# EAGLE board STM32H750VBT6_ultra (EAGLE 9.6.2)
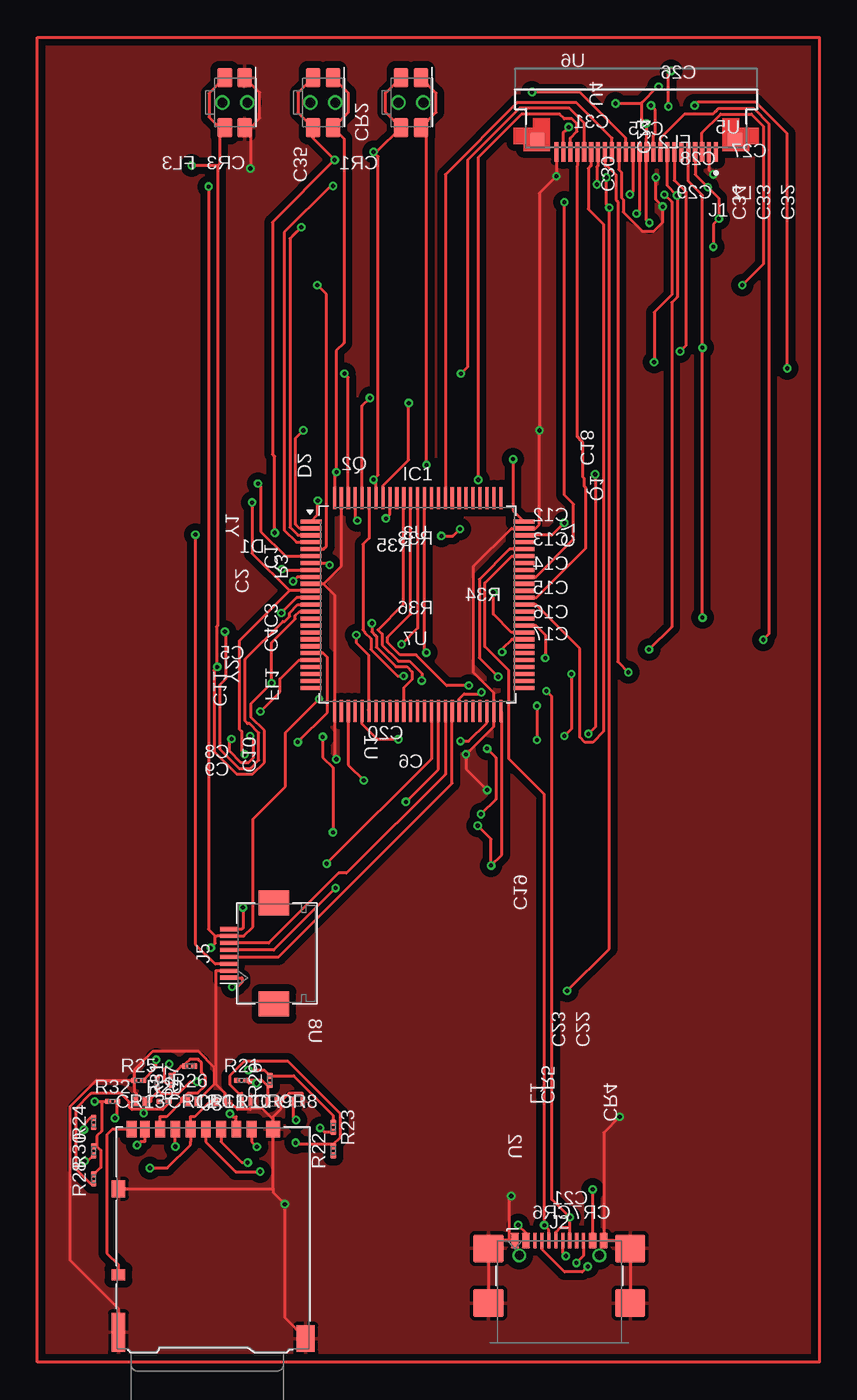
[diagram p6: board, top side]
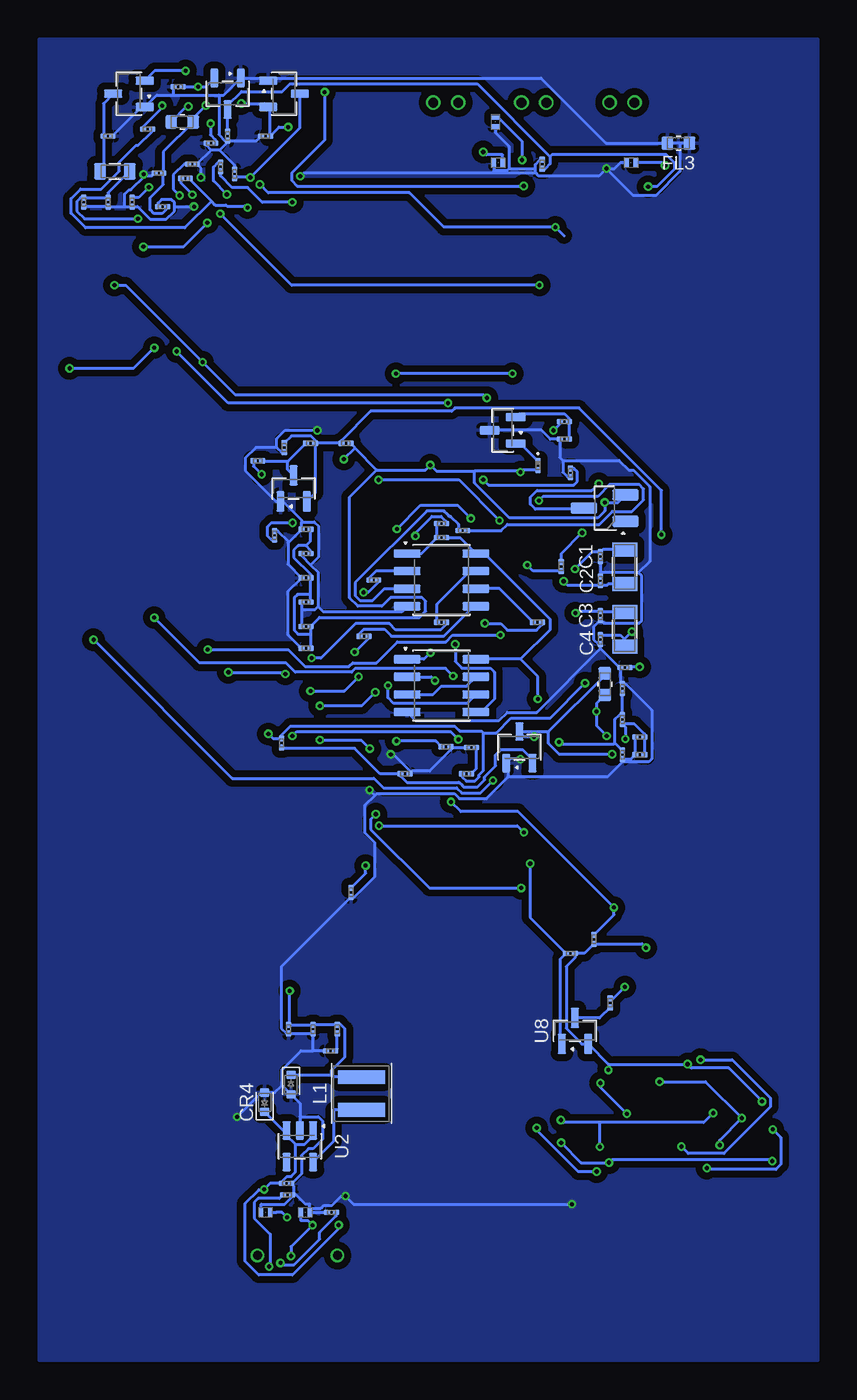
[diagram p7: board, bottom side, seen from below]

No outline drawn. Coordinates in mm, seen from the top.
Copper layers (1*16): Top 0.035mm / dielectric 1.5mm / Bottom 0.035mm
Design rules "Fusion Electronics Design Rules": minimum track width 0mil, minimum drill 0.3mm, track to track 0mil, track to pad 0mil, pad to pad 0mil, via to via 0mil, smd to smd 0mil, copper to edge 0.5mm, drill to drill 0.25mm, minimum pad ring 0.1mm, minimum via ring 0.1mm, stop-mask expansion 0mil, vias tented up to drill 9999mil, thermal gap 10mil
Net classes: 0 Default: width 0.2 mm, drill 0.3 mm, clearance 0.2 mm

## Footprints (pad centres in the part's own frame; a part is rotated, then mirrored left to right if it is on the bottom)
CAPACITOR_SMD_C_0201_0603METRIC = smd 0.46 x 0.4: 1 -0.32,0; 2 0.32,0
CAPACITOR_SMD_C_0201_0603METRIC_V1 = smd 0.46 x 0.4: 1 -0.32,0; 2 0.32,0
FOOTPRINTS_SP0402_LTF_V1 = smd 0.305 x 0.559: 1 -0.318,0; 2 0.318,0
DIODE_SMD_D_SOD-523_V1 = smd 0.6 x 0.7: 1 -0.7,0; 2 0.7,0
DIODE_SMD_D_SOD-523 = smd 0.6 x 0.7: 1 -0.7,0; 2 0.7,0
FOOTPRINTS_SP0402_LTF = smd 0.305 x 0.559: 1 -0.318,0; 2 0.318,0
PACKAGE_TO_SOT_SMD_SOT-23_HANDSOLDERING = smd 1.9 x 0.8: 1 -1.5,0.95; 2 -1.5,-0.95; 3 1.5,0
LED_SMD_LED_0201_0603METRIC = smd 0.46 x 0.4: 1 -0.32,0; 2 0.32,0
INDUCTOR_SMD_L_0603_1608METRIC = smd 0.875 x 0.95: 1 -0.787,0; 2 0.787,0
PACKAGE_QFP_LQFP-100_14X14MM_P0.5MM = smd 1.6 x 0.3: 1 -7.675,6; 2 -7.675,5.5; 3 -7.675,5; 4 -7.675,4.5; 5 -7.675,4; 6 -7.675,3.5; 7 -7.675,3; 8 -7.675,2.5; 9 -7.675,2; 10 -7.675,1.5; 11 -7.675,1; 12 -7.675,0.5; 13 -7.675,0; 14 -7.675,-0.5; 15 -7.675,-1; 16 -7.675,-1.5; 17 -7.675,-2; 18 -7.675,-2.5; 19 -7.675,-3; 20 -7.675,-3.5; 21 -7.675,-4; 22 -7.675,-4.5; 23 -7.675,-5; 24 -7.675,-5.5; 25 -7.675,-6; 51 7.675,-6; 52 7.675,-5.5; 53 7.675,-5; 54 7.675,-4.5; 55 7.675,-4; 56 7.675,-3.5; 57 7.675,-3; 58 7.675,-2.5; 59 7.675,-2; 60 7.675,-1.5; 61 7.675,-1; 62 7.675,-0.5; 63 7.675,0; 64 7.675,0.5; 65 7.675,1; 66 7.675,1.5; 67 7.675,2; 68 7.675,2.5; 69 7.675,3; 70 7.675,3.5; 71 7.675,4; 72 7.675,4.5; 73 7.675,5; 74 7.675,5.5; 75 7.675,6 | smd 0.3 x 1.6: 26 -6,-7.675; 27 -5.5,-7.675; 28 -5,-7.675; 29 -4.5,-7.675; 30 -4,-7.675; 31 -3.5,-7.675; 32 -3,-7.675; 33 -2.5,-7.675; 34 -2,-7.675; 35 -1.5,-7.675; 36 -1,-7.675; 37 -0.5,-7.675; 38 0,-7.675; 39 0.5,-7.675; 40 1,-7.675; 41 1.5,-7.675; 42 2,-7.675; 43 2.5,-7.675; 44 3,-7.675; 45 3.5,-7.675; 46 4,-7.675; 47 4.5,-7.675; 48 5,-7.675; 49 5.5,-7.675; 50 6,-7.675; 76 6,7.675; 77 5.5,7.675; 78 5,7.675; 79 4.5,7.675; 80 4,7.675; 81 3.5,7.675; 82 3,7.675; 83 2.5,7.675; 84 2,7.675; 85 1.5,7.675; 86 1,7.675; 87 0.5,7.675; 88 0,7.675; 89 -0.5,7.675; 90 -1,7.675; 91 -1.5,7.675; 92 -2,7.675; 93 -2.5,7.675; 94 -3,7.675; 95 -3.5,7.675; 96 -4,7.675; 97 -4.5,7.675; 98 -5,7.675; 99 -5.5,7.675; 100 -6,7.675
AMPHENOL_SFV24R-3STBE1HLF = smd 0.3 x 1.4: 1 -5.75,1.25; 2 -5.25,1.25; 3 -4.75,1.25; 4 -4.25,1.25; 5 -3.75,1.25; 6 -3.25,1.25; 7 -2.75,1.25; 8 -2.25,1.25; 9 -1.75,1.25; 10 -1.25,1.25; 11 -0.75,1.25; 12 -0.25,1.25; 13 0.25,1.25; 14 0.75,1.25; 15 1.25,1.25; 16 1.75,1.25; 17 2.25,1.25; 18 2.75,1.25; 19 3.25,1.25; 20 3.75,1.25; 21 4.25,1.25; 22 4.75,1.25; 23 5.25,1.25; 24 5.75,1.25 | smd 1 x 1: SH1 -7.12,0.38; SH2 7.12,0.38
CONNECTOR_USB_USB_C_RECEPTACLE_GCT_USB4110 = smd 0.6 x 1.15: A1 -3.2,3.68; A4 -2.4,3.68; A9 2.4,3.68; A12 3.2,3.68; B1 3.2,3.68; B4 2.4,3.68; B9 -2.4,3.68; B12 -3.2,3.68 | smd 0.3 x 1.15: A5 -1.25,3.68; A6 -0.25,3.68; A7 0.25,3.68; A8 1.25,3.68; B5 1.75,3.68; B6 0.75,3.68; B7 -0.75,3.68; B8 -1.75,3.68 | smd 2.18 x 2: S1_1 -5.11,3.105; S1_2 -5.11,-0.825; S1_3 5.11,3.105; S1_4 5.11,-0.825 | drill 0.65 pad 0.65: UN_1 -2.89,2.605; UN_2 2.89,2.605
CONNECTOR_CARD_MICROSD_HC_HIROSE_DM3AT-SF-PEJM5 = smd 0.7 x 1.2: 1 2.775,7.725; 2 1.675,7.725; 3 0.575,7.725; 4 -0.525,7.725; 5 -1.625,7.725; 6 -2.725,7.725; 7 -3.825,7.725; 8 -4.925,7.725; 9 -5.875,7.725 | smd 1 x 0.8: 10 -6.825,-2.775 | smd 1 x 1.2: 11_1 -6.825,3.425; 11_3 4.325,7.725 | smd 1 x 2.8: 11_2 -6.825,-6.925 | smd 1.3 x 1.9: 11_4 6.675,-7.375
CONNECTOR_FFC-FPC_HIROSE_FH12-8S-0.5SH_1X08-1MP_P0.50MM_HORIZONTAL = smd 0.3 x 1.3: 1 -1.75,1.85; 2 -1.25,1.85; 3 -0.75,1.85; 4 -0.25,1.85; 5 0.25,1.85; 6 0.75,1.85; 7 1.25,1.85; 8 1.75,1.85 | smd 1.8 x 2.2: MP_1 -3.65,-1.4; MP_2 3.65,-1.4
INDUCTOR_SMD_L_COILCRAFT_XXL4020 = smd 0.98 x 3.4: 1 -1.185,0; 2 1.185,0
INDUCTOR_SMD_L_0805_2012METRIC = smd 0.875 x 1.2: 1 -1.062,0; 2 1.062,0
PACKAGE_TO_SOT_SMD_SOT-23 = smd 1.475 x 0.6: 1 -0.938,0.95; 2 -0.938,-0.95; 3 0.938,0
RESISTOR_SMD_R_0201_0603METRIC = smd 0.46 x 0.4: 1 -0.32,0; 2 0.32,0
RESISTOR_SMD_R_0201_0603METRIC_V1 = smd 0.46 x 0.4: 1 -0.32,0; 2 0.32,0
BUTTON_SWITCH_SMD_SW_SPST_EVQP7C = smd 1.4 x 1.05: 1_1 -1.8,0.72; 1_2 1.8,0.72; 2_1 -1.8,-0.72; 2_2 1.8,-0.72 | drill 0.7 pad 0.7: UN_1 0,0.9; UN_2 0,-0.9
PACKAGE_TO_SOT_SMD_SOT-23-3 = smd 1.325 x 0.6: 1 -1.137,0.95; 2 -1.137,-0.95; 3 1.137,0
PACKAGE_TO_SOT_SMD_SOT-23-5 = smd 1.325 x 0.6: 1 -1.137,0.95; 2 -1.137,0; 3 -1.137,-0.95; 4 1.137,-0.95; 5 1.137,0.95
PACKAGE_SO_SOIC-8_3.9X4.9MM_P1.27MM = smd 1.95 x 0.6: 1 -2.475,1.905; 2 -2.475,0.635; 3 -2.475,-0.635; 4 -2.475,-1.905; 5 2.475,-1.905; 6 2.475,-0.635; 7 2.475,0.635; 8 2.475,1.905
PACKAGE_TO_SOT_SMD_SOT-23-3_V1 = smd 1.325 x 0.6: 1 -1.137,0.95; 2 -1.137,-0.95; 3 1.137,0
CRYSTAL_CRYSTAL_SMD_3215-2PIN_3.2X1.5MM = smd 1 x 1.8: 1 1.25,0; 2 -1.25,0

## Placement (x,y rotation side)
C1  CL10C100JB8NNNC  [CAPACITOR_SMD_C_0201_0603METRIC]  132.63,121.58 90 bottom
C2  CL10C100JB8NNNC  [CAPACITOR_SMD_C_0201_0603METRIC]  132.63,119.83 270 bottom
C3  CL10C100JB8NNNC  [CAPACITOR_SMD_C_0201_0603METRIC]  132.63,117.33 90 bottom
C4  CL10C100JB8NNNC  [CAPACITOR_SMD_C_0201_0603METRIC]  132.63,115.58 90 bottom
C5  CL10C100JB8NNNC  [CAPACITOR_SMD_C_0201_0603METRIC]  130.88,113.58 0 bottom
C6  CL10C100JB8NNNC  [CAPACITOR_SMD_C_0201_0603METRIC]  143.76,107.86 180 bottom
C7  CL10C100JB8NNNC  [CAPACITOR_SMD_C_0201_0603METRIC]  156.12,123.11 270 bottom
C8  CL10C100JB8NNNC  [CAPACITOR_SMD_C_0201_0603METRIC]  129.78,108.56 180 bottom
C9  CL10C100JB8NNNC  [CAPACITOR_SMD_C_0201_0603METRIC]  129.78,107.29 180 bottom
C10  CL10C100JB8NNNC  [CAPACITOR_SMD_C_0201_0603METRIC]  131.05,107.29 90 bottom
C11  CL10C100JB8NNNC  [CAPACITOR_SMD_C_0201_0603METRIC]  131.05,112.05 270 bottom
C12  CL10C100JB8NNNC  [CAPACITOR_SMD_C_0201_0603METRIC]  153.86,123.54 0 bottom
C13  CL10C100JB8NNNC  [CAPACITOR_SMD_C_0201_0603METRIC]  153.86,121.79 0 bottom
C14  CL10C100JB8NNNC  [CAPACITOR_SMD_C_0201_0603METRIC]  153.86,120.04 0 bottom
C15  CL10C100JB8NNNC  [CAPACITOR_SMD_C_0201_0603METRIC]  153.86,118.29 0 bottom
C16  CL10C100JB8NNNC  [CAPACITOR_SMD_C_0201_0603METRIC]  153.86,116.54 0 bottom
C17  CL10C100JB8NNNC  [CAPACITOR_SMD_C_0201_0603METRIC]  153.86,114.96 0 bottom
C18  CL10C100JB8NNNC  [CAPACITOR_SMD_C_0201_0603METRIC_V1]  155.43,129.43 90 bottom
C19  CL10C100JB8NNNC  [CAPACITOR_SMD_C_0201_0603METRIC]  150.6,97.37 90 bottom
C20  CL10C100JB8NNNC  [CAPACITOR_SMD_C_0201_0603METRIC]  141.94,107.82 0 bottom
C21  CL10C100JB8NNNC  [CAPACITOR_SMD_C_0201_0603METRIC]  155.26,76.39 180 bottom
C22  CL10C100JB8NNNC  [CAPACITOR_SMD_C_0201_0603METRIC]  155.1,87.5 90 bottom
C23  CL10C100JB8NNNC  [CAPACITOR_SMD_C_0201_0603METRIC]  153.35,87.5 90 bottom
C24  CL10C100JB8NNNC  [CAPACITOR_SMD_C_0201_0603METRIC]  159.51,151.89 90 bottom
C25  CL10C100JB8NNNC  [CAPACITOR_SMD_C_0201_0603METRIC]  160.72,151.38 0 bottom
C26  CL10C100JB8NNNC  [CAPACITOR_SMD_C_0201_0603METRIC]  163.07,155.45 0 bottom
C27  CL10C100JB8NNNC  [CAPACITOR_SMD_C_0201_0603METRIC]  168.15,151.89 180 bottom
C28  CL10C100JB8NNNC  [CAPACITOR_SMD_C_0201_0603METRIC]  164.47,149.22 0 bottom
C29  CL10C100JB8NNNC  [CAPACITOR_SMD_C_0201_0603METRIC]  164.21,146.81 0 bottom
C30  CL10C100JB8NNNC  [CAPACITOR_SMD_C_0201_0603METRIC]  159,149.16 270 bottom
C31  CL10C100JB8NNNC  [CAPACITOR_SMD_C_0201_0603METRIC]  156.78,151.89 0 bottom
C32  CL10C100JB8NNNC  [CAPACITOR_SMD_C_0201_0603METRIC]  169.88,147.13 90 bottom
C33  CL10C100JB8NNNC  [CAPACITOR_SMD_C_0201_0603METRIC]  168.13,147.13 90 bottom
C34  CL10C100JB8NNNC  [CAPACITOR_SMD_C_0201_0603METRIC_V1]  166.38,147.13 90 bottom
C35  CL10C100JB8NNNC  [CAPACITOR_SMD_C_0201_0603METRIC]  136.82,149.86 270 bottom
CR1  SP0402B-ULC-01ETG  [FOOTPRINTS_SP0402_LTF_V1]  140,149.97 0 bottom
CR2  SP0402B-ULC-01ETG  [FOOTPRINTS_SP0402_LTF_V1]  140.21,152.91 90 bottom
CR3  SP0402B-ULC-01ETG  [FOOTPRINTS_SP0402_LTF_V1]  130.43,149.97 0 bottom
CR4  LESD5Z5.0CT1G  [DIODE_SMD_D_SOD-523_V1]  156.84,82.23 90 bottom
CR5  LESD5Z5.0CT1G  [DIODE_SMD_D_SOD-523]  154.94,83.5 270 bottom
CR6  SP0402B-ULC-01ETG  [FOOTPRINTS_SP0402_LTF_V1]  153.92,74.3 180 bottom
CR7  SP0402B-ULC-01ETG  [FOOTPRINTS_SP0402_LTF_V1]  156.78,74.3 0 bottom
CR8  SP0402B-ULC-01ETG  [FOOTPRINTS_SP0402_LTF]  135.64,82.3 0 top
CR9  SP0402B-ULC-01ETG  [FOOTPRINTS_SP0402_LTF]  133.79,82.3 0 top
CR10  SP0402B-ULC-01ETG  [FOOTPRINTS_SP0402_LTF]  131.89,82.3 0 top
CR11  SP0402B-ULC-01ETG  [FOOTPRINTS_SP0402_LTF]  130.05,82.3 180 top
CR12  SP0402B-ULC-01ETG  [FOOTPRINTS_SP0402_LTF]  128.02,82.3 180 top
CR13  SP0402B-ULC-01ETG  [FOOTPRINTS_SP0402_LTF]  124.27,82.3 0 top
D1  BAT54C-7-F  [PACKAGE_TO_SOT_SMD_SOT-23_HANDSOLDERING]  132.32,125.07 180 bottom
D2  APT1608QBC_D  [LED_SMD_LED_0201_0603METRIC]  137.14,128.14 270 bottom
FL1  MMZ1608Y102BTA00  [INDUCTOR_SMD_L_0603_1608METRIC]  132.32,112.37 90 bottom
FL2  MMZ1608Y102BTA00  [INDUCTOR_SMD_L_0603_1608METRIC]  162.79,152.91 180 bottom
FL3  MMZ1608Y102BTA00  [INDUCTOR_SMD_L_0603_1608METRIC]  127,151.38 180 bottom
IC1  STM32H750VBT6  [PACKAGE_QFP_LQFP-100_14X14MM_P0.5MM]  144.26,118.11 0 top
J1  SFV24R-3STBE1HLF  [AMPHENOL_SFV24R-3STBE1HLF]  160.02,152 180 top
J2  USB_C_Receptacle_USB2.0_16P  [CONNECTOR_USB_USB_C_RECEPTACLE_GCT_USB4110]  154.48,68.58 0 top
J3  Micro_SD_Card_Det_Hirose_DM3AT  [CONNECTOR_CARD_MICROSD_HC_HIROSE_DM3AT-SF-PEJM5]  129.51,72.57 0 top
J5  5051100892  [CONNECTOR_FFC-FPC_HIROSE_FH12-8S-0.5SH_1X08-1MP_P0.50MM_HORIZONTAL]  132.5,92.96 90 top
L1  SRP4020TA-2R2M  [INDUCTOR_SMD_L_COILCRAFT_XXL4020]  149.86,82.87 90 bottom
L2  MLZ2012M100W  [INDUCTOR_SMD_L_0805_2012METRIC]  167.64,149.35 180 bottom
Q1  MMBT3906  [PACKAGE_TO_SOT_SMD_SOT-23]  154.75,126.49 90 bottom
Q2  BC857  [PACKAGE_TO_SOT_SMD_SOT-23]  139.68,130.68 180 bottom
R1  R  [RESISTOR_SMD_R_0201_0603METRIC]  134.8,127.61 90 bottom
R2  R  [RESISTOR_SMD_R_0201_0603METRIC]  131.05,109.83 90 bottom
R3  R  [RESISTOR_SMD_R_0201_0603METRIC_V1]  135.46,120.86 270 bottom
R4  R  [RESISTOR_SMD_R_0201_0603METRIC]  157.33,128.47 0 bottom
R5  R  [RESISTOR_SMD_R_0201_0603METRIC]  135.23,131.31 0 bottom
R6  R  [RESISTOR_SMD_R_0201_0603METRIC]  135.23,130.04 180 bottom
R7  R  [RESISTOR_SMD_R_0201_0603METRIC]  153.52,129.74 180 bottom
R8  R  [RESISTOR_SMD_R_0201_0603METRIC]  150.98,129.74 180 bottom
R9  R  [RESISTOR_SMD_R_0201_0603METRIC]  155.62,108.14 90 bottom
R10  R  [RESISTOR_SMD_R_0201_0603METRIC]  146.73,105.92 0 bottom
R11  R  [RESISTOR_SMD_R_0201_0603METRIC]  142.28,105.92 0 bottom
R12  R  [RESISTOR_SMD_R_0201_0603METRIC]  151.6,87.5 90 bottom
R13  R  [RESISTOR_SMD_R_0201_0603METRIC]  152.09,85.94 0 bottom
R14  R  [RESISTOR_SMD_R_0201_0603METRIC]  155.19,75.56 180 bottom
R15  R  [RESISTOR_SMD_R_0201_0603METRIC]  152.01,74.3 0 bottom
R16  R  [RESISTOR_SMD_R_0201_0603METRIC]  160.02,149.67 90 bottom
R17  R  [RESISTOR_SMD_R_0201_0603METRIC]  162.56,148.84 180 bottom
R18  R  [RESISTOR_SMD_R_0201_0603METRIC]  165.29,152.4 180 bottom
R19  R  [RESISTOR_SMD_R_0201_0603METRIC]  162.05,149.86 180 bottom
R20  R  [RESISTOR_SMD_R_0201_0603METRIC]  125.98,82.3 0 top
R21  R  [RESISTOR_SMD_R_0201_0603METRIC]  131.57,83.82 0 top
R22  R  [RESISTOR_SMD_R_0201_0603METRIC]  138.18,78.74 90 top
R23  R  [RESISTOR_SMD_R_0201_0603METRIC]  138.18,80.43 270 top
R24  R  [RESISTOR_SMD_R_0201_0603METRIC]  120.9,80.77 90 top
R25  R  [RESISTOR_SMD_R_0201_0603METRIC]  124.14,83.82 0 top
R26  R  [RESISTOR_SMD_R_0201_0603METRIC]  127.83,84.84 180 top
R27  R  [RESISTOR_SMD_R_0201_0603METRIC]  125.48,83.63 270 top
R28  R  [RESISTOR_SMD_R_0201_0603METRIC]  120.9,76.71 90 top
R29  R  [RESISTOR_SMD_R_0201_0603METRIC]  133.6,83.82 90 top
R30  R  [RESISTOR_SMD_R_0201_0603METRIC]  120.9,78.74 90 top
R31  R  [RESISTOR_SMD_R_0201_0603METRIC]  126.49,83.82 90 top
R32  R  [RESISTOR_SMD_R_0201_0603METRIC]  122.27,82.3 0 top
R33  R  [RESISTOR_SMD_R_0201_0603METRIC_V1]  144.08,123.95 180 bottom
R34  R  [RESISTOR_SMD_R_0201_0603METRIC_V1]  148.98,119.89 180 bottom
R35  R  [RESISTOR_SMD_R_0201_0603METRIC_V1]  142.56,123.44 180 bottom
R36  R  [RESISTOR_SMD_R_0201_0603METRIC_V1]  144.08,116.84 0 bottom
R37  R  [RESISTOR_SMD_R_0201_0603METRIC]  137.16,116.84 0 bottom
R38  R  [RESISTOR_SMD_R_0201_0603METRIC]  149.67,115.82 0 bottom
R39  R  [RESISTOR_SMD_R_0201_0603METRIC]  144.08,122.94 0 bottom
R40  R  [RESISTOR_SMD_R_0201_0603METRIC]  133.1,93.98 90 bottom
R41  R  [RESISTOR_SMD_R_0201_0603METRIC]  134.78,92.96 0 bottom
R42  R  [RESISTOR_SMD_R_0201_0603METRIC]  131.92,89.41 270 bottom
SW1  SW_Push  [BUTTON_SWITCH_SMD_SW_SPST_EVQP7C]  143.78,154.31 270 top
SW2  SW_Push  [BUTTON_SWITCH_SMD_SW_SPST_EVQP7C]  137.43,154.31 270 top
SW3  SW_Push  [BUTTON_SWITCH_SMD_SW_SPST_EVQP7C]  131.07,154.31 270 top
U1  MAX809TEUR_T  [PACKAGE_TO_SOT_SMD_SOT-23-3]  138.47,107.82 90 bottom
U2  AP2112K-3.3  [PACKAGE_TO_SOT_SMD_SOT-23-5]  154.31,79.06 270 bottom
U3  W25Q64JVSSIQ  [PACKAGE_SO_SOIC-8_3.9X4.9MM_P1.27MM]  144.08,119.89 0 bottom
U4  PMIC-LDO-XC6206P332MR-G_SOT23_  [PACKAGE_TO_SOT_SMD_SOT-23-3_V1]  159.51,154.94 270 bottom
U5  PMIC-LDO-XC6206P332MR-G_SOT23_  [PACKAGE_TO_SOT_SMD_SOT-23-3_V1]  166.62,154.94 180 bottom
U6  PMIC-LDO-XC6206P332MR-G_SOT23_  [PACKAGE_TO_SOT_SMD_SOT-23-3_V1]  155.45,154.94 0 bottom
U7  W25Q64JVSSIQ  [PACKAGE_SO_SOIC-8_3.9X4.9MM_P1.27MM]  144.08,112.27 0 bottom
U8  SI2301CDS-T1-GE3  [PACKAGE_TO_SOT_SMD_SOT-23]  134.46,87.38 90 bottom
Y1  ABS05-32.768KHZ-7-T  [CRYSTAL_CRYSTAL_SMD_3215-2PIN_3.2X1.5MM]  130.88,120.83 270 bottom
Y2  ABM3-25.000MHZ-D2Y-T  [CRYSTAL_CRYSTAL_SMD_3215-2PIN_3.2X1.5MM]  130.88,116.33 90 bottom

## Tracks (layer width: path | path; a pad name or v marks a point on that pad's centre or on a via)
0.96''_TFT-LCD_LCD_LEDA  (via drill 0.3 pad 0.6)
  Top 0.2: v130.87,90.54 | v130.87,90.54 131.27,90.54 131.6,90.88 131.6,91.21 J5.1
  Bottom 0.2: v130.87,90.54 131.69,89.73 R42.1
+1V5  (via drill 0.3 pad 0.6)
  Top 0.2: J1.10 161.27,151.95 161.4,152.07 161.4,153.79 v161.09,154.1
  Bottom 0.2: C29.2 164,146.71 164,146.55 164.24,146.31 164.84,146.31 165.11,146.57 165.11,147.44 164.15,148.4 C28.2 164.15,150.76 FL2.1 162,153.19 v161.09,154.1
+2V8  (via drill 0.3 pad 0.6)
  Top 0.2: 160.43,154.24 v158.53,154.24 | v160.97,145.64 160.77,145.84 J1.11 160.77,151.75 160.77,152.77 v160.74,152.8 160.43,153.11 160.43,154.24 | v155.15,152.54 154.86,152.26 154.77,152.17 J1.23 | 160.43,154.24 160.43,154.31 161.56,155.45 v161.64,155.45 | J1.4 164.27,149.12 v165.19,148.21 165.99,147.41 | v165.59,143.91 165.59,145.53 v165.99,145.93 165.99,147.41 | 165.99,147.41
  Bottom 0.2: C26.2 v161.64,155.45 161.09,155.45 U4.2 | L2.1 168.13,147.79 C33.2 C32.2 170.11,147.45 170.39,147.17 170.39,146.48 169.84,145.93 v165.99,145.93 | v165.59,143.91 162.7,143.91 v160.97,145.64 | v160.74,152.8 160.74,151.99 160.4,151.65 C25.2 | C34.2 165.94,147.45 v165.19,148.21 | v158.53,154.24 156.84,154.24 U6.2 156.46,153.87 C31.2 155.81,152.54 v155.15,152.54 | v155.15,152.54
+3.3V  (via drill 0.3 pad 0.6)
  Top 0.2: v155.04,90.26 158.08,93.3 v158.08,146.73 157.87,146.94 v157.87,148.92
  Bottom 0.2: L1.2 151.86,84.05 152.01,84.2 | 160.68,147.21 162.6,145.28 169.76,145.28 170.8,146.32 170.8,147.39 170.12,148.07 168.63,148.07 167.33,149.38 167.33,150.01 166.12,151.22 165.97,151.22 164.97,152.22 R18.1 | v158.08,146.73 158.19,146.73 158.31,146.86 159.56,146.86 159.63,146.93 160.4,146.93 160.68,147.21 | R17.1 162.24,148.77 160.68,147.21 | 152.01,84.2 152.01,84.53 151.06,85.49 151.06,87.53 151.35,87.82 R12.2 C23.2 155.04,87.82 | U6.3 154.31,152.48 v157.87,148.92 158.93,148.92 C30.2 | C22.2 155.04,87.82 | 155.04,87.82 v155.04,90.26 | CR5.1 152.01,84.2
+3V3  (via drill 0.3 pad 0.6)
  Top 0.2: R23.1 138.18,81.28 135.32,84.14 R29.2 133.19,84.56 v132.05,84.56 | v129.34,93.37 129.66,93.69 129.66,94.21 | R32.1 121.94,82.29 121.46,82.29 | 129.66,94.21 129.8,94.21 130.22,94.21 J5.7 131.71,94.21 132.38,94.88 132.38,102.66 134.73,105.01 134.73,108.89 v137.15,111.3 | 121.11,79.06 121.41,78.77 121.41,77.53 R28.2 | R31.1 126.23,83.5 125.98,83.75 125.98,84.61 v126.34,84.98 | v120.97,82.29 121.46,82.29 | 121.46,82.29 121.46,80.14 121.11,79.8 121.11,79.06 | 129.66,94.21 129.18,94.7 129.18,148.24 v129.19,148.25 | R30.2 121.11,79.06
  Bottom 0.2: 138.39,114.17 137.15,112.93 v137.15,111.3 | 138.39,114.17 U7.8 | 132.05,84.98 U8.2 133.97,86.44 135.09,87.56 135.09,92.02 134.46,92.64 R41.2 133.79,92.96 R40.1 129.63,93.66 v129.34,93.37 | v120.97,82.29 123.38,84.7 126.06,84.7 v126.34,84.98 132.05,84.98 | 136.25,150.41 141.51,155.67 155.02,155.67 155.57,155.11 158.51,155.11 159.51,154.11 U4.3 C24.2 | R39.2 142.75,122.94 U3.8 140.99,121.79 136.29,117.09 136.29,116.28 138.39,114.17 | 136.25,150.41 136.25,149.9 136.61,149.54 C35.2 | v129.19,148.25 128.55,148.25 127.3,149.5 127.3,149.98 127.89,150.58 136.09,150.58 136.25,150.41 | 132.05,84.98 v132.05,84.56
+5V  (via drill 0.3 pad 0.6)
  Top 0.2: v151.51,73.37 152.08,72.8 J2.B9 | v156.88,75.94 J2.B4
  Bottom 0.2: 154.62,79.18 155.25,79.82 U2.3 155.51,80.2 CR4.1 | v151.51,73.37 151.51,73.11 154.83,69.79 157.27,69.79 158.25,70.76 158.25,74.93 157.26,75.92 156.9,75.92 | 156.9,75.92 | 154.62,79.18 153.96,79.18 153.35,79.79 U2.1 | 156.9,75.92 v156.88,75.94 156.44,76.39 C21.2 155.58,76.55 155.24,76.89 154.93,76.89 154.62,77.2 154.62,79.18
BOOT0  (via drill 0.3 pad 0.6)
  Top 0.2: IC1.94 141.25,126.94 v141.08,127.12 141.42,127.46 141.42,150.41 v141.08,150.75 141.3,150.75 SW1.2_2 141.94,153.62 141.94,154.99 SW1.2_1
  Bottom 0.2: R1.2 134.53,127.93 134.29,127.69 134.29,126.99 134.55,126.74 140.7,126.74 v141.08,127.12 | CR1.2 139.69,150.55 140.88,150.55 v141.08,150.75
DCMI_D0
  Top 0.2: J1.19 156.77,149.75 156.57,149.54 156.57,146.64 157.67,145.54 157.67,108.97 156.88,108.18 156.33,108.18 155.95,108.55 155.95,114.94 152.78,118.11 IC1.63
DCMI_D1
  Top 0.2: 156.28,126.65 156.39,126.54 | 156.39,126.54 156.39,122.18 152.81,118.61 IC1.64 | 155.94,130.06 155.77,130.22 | 155.94,130.06 155.77,130.22 | 155.77,130.22 155.77,149.75 J1.21 | 156.28,126.65 156.28,127.21 156.17,127.32 156.17,129.82 155.94,130.06 | 156.28,126.65 156.39,126.54
DCMI_D2  (via drill 0.3 pad 0.6)
  Top 0.2: v148.62,127.11 148.62,150.35 151.75,153.47 154.5,153.47 154.83,153.14 155.4,153.14 155.75,152.79 155.75,152.23 155.27,151.75 J1.22 | IC1.97 139.75,124.33 v139.91,124.18
  Bottom 0.2: v148.62,127.11 142.84,127.11 v139.91,124.18
DCMI_D3  (via drill 0.3 pad 0.6)
  Top 0.2: v147.38,134.76 147.86,135.25 147.86,150.16 151.59,153.9 155.21,153.9 156.27,152.84 J1.20 | IC1.98 139.25,134.49 v138.98,134.76
  Bottom 0.2: v138.98,134.76 v147.38,134.76
DCMI_D4  (via drill 0.3 pad 0.6)
  Top 0.2: v135.87,145.33 135.05,144.5 135.05,123.69 135.63,123.11 IC1.3 | J1.18 157.27,149.75 157.19,149.66 v157.19,148.41 | v135.87,145.33 135.25,144.71 v135.87,145.33
  Bottom 0.2: v135.87,145.33 135.25,144.71 v135.87,145.33 | v157.19,148.41 156.59,147.81 146.4,147.81 143.92,145.33 v135.87,145.33
DCMI_D5
  Top 0.2: J1.16 158.27,151.75 155.72,154.3 151.43,154.3 146.25,149.12 IC1.84
DCMI_D6  (via drill 0.3 pad 0.6)
  Top 0.2: IC1.4 135.51,122.61 134.65,123.48 134.65,144.95 137.99,148.29 v138.16,148.29 | v152.51,155.06 155.95,155.06 159.27,151.75 J1.14
  Bottom 0.2: v138.16,148.29 154.49,148.29 154.9,148.7 154.9,149.22 152.51,151.61 v152.51,155.06
DCMI_D7  (via drill 0.3 pad 0.6)
  Top 0.2: v137.03,141.14 137.68,140.49 137.68,122.31 137.48,122.11 IC1.5 | J1.12 160.27,146.53 v160.04,146.3
  Bottom 0.2: v160.04,146.3 154.88,141.14 v137.03,141.14
DCMI_HSYNC  (via drill 0.3 pad 0.6)
  Top 0.2: J1.9 161.77,151.75 163.51,153.49 165.55,153.49 | 165.71,153.65 165.55,153.49 | IC1.28 139.25,106.56 v140.38,105.43 | 165.71,153.65 165.95,153.89 168.49,153.89 169.6,152.77 169.6,115.99 v169.18,115.58 | 165.71,153.65 165.55,153.49
  Bottom 0.2: v169.18,115.58 159.19,105.58 148.96,105.58 148.27,104.9 142.99,104.9 142.63,104.53 141.28,104.53 v140.38,105.43
DCMI_PIXCLK  (via drill 0.3 pad 0.6)
  Top 0.2: v154.84,108.64 155.35,109.15 v155.35,113.1 | IC1.30 140.25,109.49 141.35,108.39 v142.87,108.39 | v159.46,113.23 158.69,114 158.69,147.15 158.56,147.27 158.56,149.09 157.91,149.75 157.77,149.75 J1.17
  Bottom 0.2: v159.46,113.23 155.48,113.23 v155.35,113.1 | v154.84,108.64 154.54,108.95 143.43,108.95 v142.87,108.39
DCMI_VSYNC  (via drill 0.3 pad 0.6)
  Top 0.2: v163.19,136.37 163.59,136.77 163.59,147.88 162.77,148.7 J1.7 | v143.62,132.65 143.62,128.54 141.75,126.68 IC1.93
  Bottom 0.2: v163.19,136.37 159.47,132.65 v143.62,132.65
DVP_PWDN  (via drill 0.3 pad 0.6)
  Top 0.2: v160.94,114.87 162.58,116.51 162.58,139.89 162.98,140.29 162.98,147.6 v162.97,147.61 162.27,148.31 J1.8 | v139.83,115.92 139.83,115.37 140.71,114.49 140.71,110.48 IC1.31
  Bottom 0.2: v162.97,147.61 163.43,148.07 163.43,149.09 162.66,149.86 R19.2 | v139.83,115.92 143.28,115.92 143.78,115.42 147.28,115.42 148.79,113.91 150.49,113.91 150.74,113.65 153.93,113.65 155.15,114.87 v160.94,114.87
EARTH  (via drill 0.3 pad 0.6)
  Top 0.2: 134.4,82.3 134.4,81.76 133.84,81.2 133.84,81 | 132.21,81.81 132.21,81.72 131.26,81.72 130.8,82.17 130.37,82.17 130.37,82.23 CR11.1 130.37,82.88 129.68,83.57 | CR10.2 132.21,81.86 132.21,81.81 | J3.11_2 122.69,67.35 119.19,70.84 119.19,81.93 121.08,83.82 R25.1 | 132.21,81.81 133.02,81.81 133.84,81 | R25.1 123.82,84.56 125.16,85.9 128.45,85.9 129.63,84.72 129.63,83.57 | J1.24 v154.27,149 153.04,147.77 v153.04,130.68 153.04,123.89 152.76,123.61 IC1.74 151.03,123.61 148.3,120.88 148.3,113.21 149.75,111.75 IC1.49 149.75,109.32 v147.75,107.32 147.75,106.27 v149.28,104.74 | CR9.2 134.4,82.3 | J1.15 158.77,149.48 158.97,149.29 158.97,147.44 159.09,147.32 159.09,146.41 160.46,145.03 161.28,145.03 161.94,145.69 v161.94,146.81 161.44,147.31 v161.44,148.91 | 133.84,75.99 J3.11_3 133.84,81 | CR13.1 123.95,82.88 123.82,83.02 R25.1 | 137.46,119.61 138.25,118.82 IC1.26 138.25,107.11 v138.4,106.97 | J2.S1_2 J2.S1_1 149.94,72.26 150.85,72.26 | IC1.99 138.75,120.9 137.46,119.61 | J2.B12 150.85,72.26 | J2.S1_4 J2.S1_3 159.01,72.26 J2.B1 157.68,80.03 v158.82,81.18 | CR8.2 135.95,82.88 134.98,82.88 134.4,82.3 | J3.11_4 134.68,66.69 v134.68,74.88 133.84,75.73 133.84,75.99 | v165.58,149.14 165.27,149.44 J1.2 | J3.11_1 133.84,75.99 | CR12.1 128.41,82.3 128.41,82.34 129.63,83.57 | 132.19,152.5 v132.19,149.56 | v151.01,75.46 150.85,75.31 150.85,72.26 | 129.68,83.57 129.69,83.58 129.69,91.71 J5.2 | SW3.1_2 132.19,152.5 | SW3.1_1 132.88,155.02 132.88,153.19 132.19,152.5 | 129.68,83.57 129.63,83.57 | 137.46,119.61 IC1.10
  Bottom 0.2: C1.1 132.63,120.41 | 132.63,114.94 137.22,110.35 139.35,110.35 139.94,109.76 145.96,109.76 U7.4 | 148.89,104.36 v149.28,104.74 | R1.1 134.97,127.29 135.34,127.65 135.34,128.51 | 163.35,146.81 v161.94,146.81 | 155.98,129.45 157.48,129.45 158.25,128.68 158.25,127.79 156.02,125.56 Q1.1 155.52,125.56 154.18,124.2 154.18,124.08 | 153.52,120.98 152.99,120.45 152.99,117.98 | 160.7,150.89 160.69,150.88 160.1,150.88 | v158.82,81.18 157.07,82.93 CR4.2 156.12,82.93 155.59,83.46 | 142.81,104.14 142.79,104.13 140.83,104.13 139.29,105.67 139.29,105.72 | 129.87,120.41 129.66,120.19 129.66,116.94 129.83,116.77 132.38,116.77 C3.1 133.13,116.5 133.13,115.61 132.78,115.26 C4.1 132.63,114.94 | 154.73,75.7 | 154.18,124.08 C12.1 155.09,122.62 | v134.68,74.88 150.43,74.88 v151.01,75.46 | Q2.3 136.87,130.68 136.24,130.04 R6.2 135.55,128.72 135.34,128.51 | 131.05,106.77 C10.1 130.42,106.97 C9.2 C8.2 | C27.1 165.73,153.99 U5.1 164.63,154.85 163.39,154.85 | 153.6,74.59 CR6.1 R15.1 | 154.65,75.62 153.9,74.88 153.6,74.88 153.6,74.59 | 142.81,104.14 143.16,104.49 148.76,104.49 148.89,104.36 | CR7.1 157.09,74.88 155.4,74.88 154.65,75.62 | 139.23,149.53 137.32,149.53 | 165.48,149.04 166.49,148.02 166.62,148.02 166.94,147.71 166.94,146.81 | 166.94,146.81 C33.1 C32.1 | v147.75,107.32 147.56,107.32 146.28,106.04 | 160.1,150.88 159,149.79 C30.1 | C13.1 154.18,121.63 153.52,120.98 | C17.1 155.14,115.93 155.14,119.07 C14.1 155.16,121.03 155.16,122.56 155.09,122.62 | 135.34,128.51 131.28,128.51 130.57,127.79 130.25,127.79 129.06,126.61 129.06,121.22 129.87,120.41 | C15.1 154.18,117.75 | 155.98,129.45 155.98,130.07 155.37,130.68 v153.04,130.68
  Bottom 0.2: v154.27,149 154.02,149.24 137.32,149.24 | 160.7,150.89 161.04,151.22 C25.1 | 165.48,149.04 | 153.52,120.98 152.95,121.55 152.95,123.77 153.26,124.08 154.18,124.08 | 154.73,75.7 154.73,76.17 C21.1 154.86,76.39 154.18,77.06 154.18,78.4 153.69,78.89 153.36,78.89 152.68,79.57 152.68,80.9 152.97,81.18 154.31,81.18 | 166.94,146.81 C34.1 166.01,146.81 165.11,145.91 163.94,145.91 163.35,146.49 163.35,146.81 | R13.1 153.35,85.94 | 131.05,106.77 129.15,106.77 128.92,106.99 128.92,110.5 130.79,112.37 C11.1 131.2,112.52 C5.1 131.27,113.58 132.63,114.94 | U3.4 146.95,117.59 152.6,117.59 152.99,117.98 | 137.32,149.53 137.32,149.84 136.98,150.18 C35.1 | 163.39,154.85 160.14,154.85 | 139.23,149.53 139.37,149.38 140.32,149.38 CR1.1 | R14.1 154.73,75.7 | v138.4,106.97 139.14,106.97 U1.1 139.29,106.55 139.29,105.72 | 139.29,105.72 132.09,105.72 131.05,106.77 | 160.14,154.85 159.79,154.85 U4.1 156.77,156.08 U6.1 156.41,156.07 136.91,156.07 132.23,151.38 FL3.2 126.89,151.38 | 137.32,149.24 137.32,149.53 | C35.1 | 152.99,117.98 153.22,117.75 154.18,117.75 | 129.87,120.41 132.63,120.41 | v132.19,149.56 130.25,147.61 128.62,147.61 126.89,149.34 126.89,151.38 | v132.19,149.56 131.6,149.56 131.2,149.97 CR3.1 | v161.44,148.91 161.44,149.57 R19.1 160.7,150.89 | 154.31,81.18 154.31,82.17 CR5.2 155.59,83.46 | C20.1 142.29,107.79 143.37,107.79 C6.1 143.44,107.62 144.95,106.11 146.22,106.11 146.28,106.04 | C24.1 159.51,151.47 160.1,150.88 | 139.23,149.53 139.23,151.16 140.21,152.14 CR2.1 | 142.81,104.14 | 137.32,149.24 137.09,149.01 132.74,149.01 v132.19,149.56 | C24.1 159.72,151.57 160.14,151.99 160.14,154.85
  Bottom 0.2: v151.01,75.46 151.32,75.46 151.99,74.8 152.58,74.8 152.79,74.59 153.6,74.59 | 163.39,154.85 C26.1 | 148.89,104.36 149.6,103.65 149.6,101.64 148.89,100.93 148.89,98.51 150.35,97.05 C19.1 155.65,92 155.65,87.57 155.26,87.18 C22.1 C23.1 153.35,85.94 | v151.01,75.46 | 154.18,117.75 C16.1 | C31.1 157.42,151.57 C24.1 | C29.1 164.53,147.07 164.28,147.32 163.56,147.32 163.35,147.12 163.35,146.81 | 165.48,149.04 164.97,149.04 C28.1 | 132.63,120.41 C2.1 | FL3.1 126.89,151.38 | C25.1 | 154.65,75.62 154.73,75.7 | 165.48,149.04 v165.58,149.14 | 155.09,122.62 155.9,123.43 C7.1 | R10.2 146.28,106.04 | 155.59,83.46 155.59,84.57 154.22,85.94 153.35,85.94 | 155.98,129.45 155.63,129.11 C18.1 | 154.31,81.18 U2.2
  pour Top (isolate 0.5, rank 6): 116.97,63.62 173.1,63.62 173.1,158.88 116.97,158.88
  pour Bottom (isolate 0.5): 116.97,63.62 173.1,63.62 173.1,158.88 116.97,158.88
I2C1_SCL  (via drill 0.3 pad 0.6)
  Top 0.2: v143.25,112.96 142.81,112.96 140.89,114.88 140.89,115.66 140.44,116.11 140.44,116.17 140.31,116.29 140.31,122.47 140.75,122.91 IC1.95 | v164.23,154.09 164.48,154.34 168.66,154.34 170.91,152.08 v170.91,135.15 | J1.5 163.77,148.65 164.8,147.62 v164.8,136.63 v164.8,117.17
  Bottom 0.2: v170.91,135.15 166.29,135.15 v164.8,136.63 | R18.2 165.61,152.56 164.23,153.94 v164.23,154.09 | v143.25,112.96 143.79,113.51 150.32,113.51 150.57,113.25 154.65,113.25 155.3,113.91 161.53,113.91 v164.8,117.17
I2C1_SDA  (via drill 0.3 pad 0.6)
  Top 0.2: J1.3 164.77,152.13 166.12,153.48 168.32,153.48 169.18,152.62 169.18,142.65 v167.68,141.14 | v162.05,147.67 162.58,147.15 162.58,140.46 161.31,139.19 v161.31,135.6 | v140.82,133.01 140.25,132.45 IC1.96
  Bottom 0.2: v140.82,133.01 141.05,133.25 158.97,133.25 v161.31,135.6 166.86,141.14 v167.68,141.14 | R17.2 162.88,148.5 v162.05,147.67
LCD_CS  (via drill 0.3 pad 0.6)
  Top 0.2: J5.8 131.6,94.71 131.65,94.77 v131.65,96.27 | IC1.41 145.75,106.24 v143.41,103.89
  Bottom 0.2: R40.2 131.65,95.74 v131.65,96.27 138.57,103.18 142.7,103.18 v143.41,103.89
LCD_LED  (via drill 0.3 pad 0.6)
  Top 0.2: v137.7,99.44 145.25,106.99 IC1.40
  Bottom 0.2: U8.1 135.5,86.52 135.5,92.57 R41.1 137.7,95.56 v137.7,99.44
LCD_RESET  (via drill 0.3 pad 0.6)
  Top 0.2: J5.3 129.69,92.21 129.64,92.21 128.23,93.62 v128.23,123.15
  Bottom 0.2: 128.23,123.32 128.23,126.34 134.17,132.28 143.13,132.28 143.37,132.05 149.2,132.05 151.3,129.95 R8.2 R7.1 | v128.23,123.15 128.23,123.32 | R7.1 153.2,126.16 Q1.2 | v128.23,123.15 128.23,123.32 | C18.2 154.9,130.27 153.5,130.27 153.2,129.97 R7.1 | 128.23,123.32 v128.23,123.15
LCD_SCL
  Top 0.2: IC1.42 146.25,105.88 139.13,98.76 138.57,98.76 133.53,93.71 J5.6
LCD_SDA  (via drill 0.3 pad 0.6)
  Top 0.2: J5.5 133.88,93.21 v138.34,97.67 | v149.27,107.73 149.91,107.09 149.91,104.08 v148.83,103 | v152.87,110.81 v152.87,108.35 | v148.87,111.79 148.75,111.67 147.61,111.67 147.25,111.32 IC1.44
  Bottom 0.2: v152.87,108.35 149.88,108.35 v149.27,107.73 | v138.34,97.67 144.95,97.67 149.19,101.92 149.19,102.63 v148.83,103 | v152.87,110.81 149.84,110.81 v148.87,111.79
LCD_WR_RS
  Top 0.2: J5.4 134.24,92.71 146.74,105.22 146.74,110.42 IC1.43
MICROSD_MICROSD_SW
  Top 0.2: J3.9 122.24,80.29 121.84,79.89 121.84,71.34 122.69,70.5 J3.10
N$4
  Bottom 0.2: 155.17,128.41 155.17,127.85 Q1.3 | R7.2 155.17,128.41 | 155.17,128.41 156.95,128.41 R4.2
N$5  (via drill 0.3 pad 0.6)
  Top 0.2: IC1.13 135.61,118.11 135.03,117.52 135.03,117.25 134.67,116.9 134.54,116.9 131.82,114.18 131.82,109.71 131.99,109.54 132.13,109.54 132.8,108.86 132.8,106.9 132.2,106.3 131.37,106.3 129.98,107.69 129.98,112.32 130.41,112.75 130.41,116.11 v130.35,116.16
  Bottom 0.2: C4.2 131.19,115.9 130.9,115.61 | 130.9,115.61 v130.35,116.16 | 130.9,115.61 130.88,115.59 Y2.2
N$8
  Bottom 0.2: D2.1 138.41,129.73 Q2.1
N$9  (via drill 0.3 pad 0.6)
  Top 0.2: 133.78,128.96 133.95,128.79 | 133.78,128.96 133.95,128.79 | 133.78,128.96 133.78,145.68 v138.28,150.17 136.71,151.75 SW2.2_2 135.62,153.59 135.62,155.02 SW2.2_1 | v133.95,123.29 133.95,128.79
  Bottom 0.2: v133.95,123.29 135.46,121.79 R3.1 | CR2.2 139.98,153.23 138.28,151.52 v138.28,150.17
N$10
  Bottom 0.2: 140.18,106.48 | 142.59,105.06 142.83,105.3 146.59,105.3 147.05,105.76 R10.1 148.52,105.92 150.35,107.74 155.54,107.74 R9.1 | U1.2 137.52,106.94 138.24,107.66 139.8,107.66 140.18,107.28 140.18,106.48 | 142.59,105.06 142.48,104.95 | 140.18,106.48 140.98,105.68 140.98,105.47 141.51,104.95 142.48,104.95 | 142.59,105.06 142.48,104.95
N$15  (via drill 0.3 pad 0.6)
  Top 0.2: IC1.20 137.43,114.61 137.75,114.3 137.75,110.33 v135.61,108.2
  Bottom 0.2: v135.61,108.2 135.44,108.03 131.67,108.03 131.57,108.13 | 131.57,108.13 131.57,109.85 131.27,110.15 R2.2 C11.2 | C10.2 131.57,108.13
N$27
  Bottom 0.2: Q2.2 138.49,131.88 135.24,131.88 134.91,131.55 R5.2 R6.1
N$28  (via drill 0.3 pad 0.6)
  Top 0.2: IC1.9 135.6,120.11 v135.28,119.79
  Bottom 0.2: v135.28,119.79 135,119.51 C2.2 132.15,119.51 132.08,119.58 Y1.1
N$29  (via drill 0.3 pad 0.6)
  Top 0.2: IC1.8 134.52,120.61 v134.46,120.67
  Bottom 0.2: v134.46,120.67 133.23,121.9 C1.2 132.45,122.08 132.08,122.08 Y1.2
N$46  (via drill 0.3 pad 0.6)
  Top 0.2: v132.91,110.4 134.33,111.82 134.33,112.75 135.69,114.11 IC1.21 | v130.83,108.42 130.69,108.28 130.69,107.54 131.53,106.7 132.03,106.7 132.4,107.07 132.4,108.42 v132.18,108.64
  Bottom 0.2: v132.18,108.64 132.91,109.38 v132.91,110.4 132.91,110.98 FL1.1 | v130.83,108.42 130.83,109.3 R2.1 130.18,109.51 129.46,108.78 C8.1 C9.1
N$48  (via drill 0.3 pad 0.6)
  Top 0.2: v134.42,117.5 135.53,118.61 IC1.12
  Bottom 0.2: Y2.1 132.56,117.58 C3.2 134.28,117.65 v134.42,117.5
N$55  (via drill 0.3 pad 0.6)
  Top 0.2: v154.83,124.01 153.93,123.11 IC1.73
  Bottom 0.2: v154.83,124.01 156.35,124.01 156.62,123.74 156.62,123.04 156.37,122.79 C7.2
N$56  (via drill 0.3 pad 0.6)
  Top 0.2: IC1.48 149.25,109.59 147.94,108.27 v147.34,108.27
  Bottom 0.2: v147.34,108.27 144.49,108.27 C6.2
N$66
  Bottom 0.2: R42.2 132.7,88.31 U8.3
N$73
  Bottom 0.2: U5.3 168.47,154.23 C27.2 168.47,149.59 L2.2
N$91  (via drill 0.3 pad 0.6)
  Top 0.2: v162.54,156.6 162.34,156.4 v162.34,154.03
  Bottom 0.2: v162.34,154.03 162.46,154.03 FL2.2 | U5.2 164.78,156.6 v162.54,156.6
N$97  (via drill 0.3 pad 0.6)
  Top 0.2: J1.13 159.77,147.89 v159.57,147.69 | v159.57,147.69
  Bottom 0.2: v159.57,147.69 | R16.2 160.21,149.99 160.54,149.66 160.54,148.66 v159.57,147.69
N$103  (via drill 0.3 pad 0.6)
  Top 0.2: v132.9,77.23 | v137.22,80.38 137.5,80.11 R23.2 | J3.4 128.99,79.39 131.15,77.23 v132.9,77.23
  Bottom 0.2: v137.22,80.38 137.22,80.23 134.23,77.23 v132.9,77.23
N$110  (via drill 0.3 pad 0.6)
  Top 0.2: v135.46,79.31 135.58,79.19 138.18,79.19 | J3.3 130.09,79.39 131.6,77.88 v132,77.88 | v120.23,77.99 120.47,77.99 R30.1 | 138.18,79.19 R22.2 | CR10.1 131.57,82.88 131.34,82.88 130.7,83.52 130.7,84.13 131.75,85.17 134.93,85.17 138.69,81.41 138.69,79.71 138.18,79.19
  Bottom 0.2: v120.23,77.99 120.34,78.11 131.78,78.11 v132,77.88 134.02,77.88 v135.46,79.31
N$111  (via drill 0.3 pad 0.6)
  Top 0.2: R20.2 126.3,82.14 125.88,81.71 124.5,81.71 | R28.1 120.64,76.39 119.59,77.44 119.59,81.77 120.66,82.83 120.72,82.89 122.83,82.89 123.47,82.25 123.47,81.89 123.66,81.71 124.5,81.71 | v132.66,79.02 132.28,79.39 J3.1 | v135.49,80.95 135.32,81.12 CR8.1 | 124.5,81.71 v124.5,81.45
  Bottom 0.2: v132.66,79.02 132.66,80.77 | v135.49,80.95 135.31,80.77 132.66,80.77 | 132.66,80.77 125.18,80.77 v124.5,81.45
N$112  (via drill 0.3 pad 0.6)
  Top 0.2: v130.72,81.4 130.93,81.2 131.19,81.2 J3.2 | CR9.1 133.48,83.37 | 133.48,83.37 133.03,83.82 R21.2 132.1,83.62 v132.63,83.62 | 133.48,83.37 R29.1
  Bottom 0.2: v130.72,81.4 132.63,83.32 v132.63,83.62
N$115
  Top 0.2: 127.24,82.3 126.14,81.2 125.69,81.2 J3.7 | 127.24,82.3 127.24,82.51 127.3,82.57 127.41,82.57 127.65,82.8 127.65,82.84 127.7,82.9 128.39,82.9 128.96,83.46 128.96,84.1 128.68,84.38 128.68,85.1 128.44,85.34 127.85,85.34 127.51,85 R26.2 127.19,84.84 R31.2 | CR12.2 127.24,82.3
N$120  (via drill 0.3 pad 0.6)
  Top 0.2: v124.95,77.49 126.2,77.49 127.89,79.18 127.89,79.39 J3.5 127.89,80.75 127.89,81.2 128.18,81.2 129.28,82.3 CR11.2 | v120.2,80.27 120.2,80.64 120.65,81.09 R24.2
  Bottom 0.2: v124.95,77.49 124.85,77.39 119.98,77.39 119.62,77.74 119.62,79.7 v120.2,80.27
N$130  (via drill 0.3 pad 0.6)
  Top 0.2: v126.79,79.04 v126.78,79.05 J3.6 | R25.2 125.41,84.77 v125.41,85.3
  Bottom 0.2: v125.41,85.3 123.12,85.3 120.36,82.54 120.36,81.91 123.72,78.54 126.3,78.54 v126.79,79.04
N$133  (via drill 0.3 pad 0.6)
  Top 0.2: v124.03,79.14 124.27,79.39 124.58,79.39 J3.8 | 125.59,83.06 125.04,82.51 125.04,82.3 CR13.2 | v128.36,83.71 127.86,83.71 127.03,82.88 125.76,82.88 125.59,83.06 | R32.2 122.58,81.25 v122.43,81.09 | R27.2 125.48,83.17 125.59,83.06
  Bottom 0.2: v124.03,79.14 124.03,79.5 v122.43,81.09 125.05,83.71 v128.36,83.71
N$144
  Bottom 0.2: L1.1 151.86,81.68 151.86,79.42 U2.5
N$157
  Bottom 0.2: R12.1 151.6,86.1 R13.2
N$161
  Bottom 0.2: U7.3 144.7,111.63 144.1,112.23 142.28,112.23 U7.7
N$162
  Bottom 0.2: 143.67,124.63 143.5,124.46 | U3.3 148.22,119.25 149.07,118.39 149.95,118.39 150.31,118.76 150.31,119.69 145.14,124.86 143.91,124.86 143.67,124.63 | 143.67,124.63 143.5,124.46 | R35.2 142.88,123.91 143.43,124.46 143.5,124.46
N$163
  Bottom 0.2: U3.1 145.55,121.79 R39.1 R33.2
N$164
  Bottom 0.2: U3.2 148.82,120.52 149.3,120.05 R34.2
N$165
  Bottom 0.2: R36.1 144.4,118.14 142.02,120.52 U3.7
N$166
  Bottom 0.2: R38.1 149.99,116.03 149.69,116.34 148.2,116.34 147.71,115.84 143.93,115.84 141.78,117.98 U3.5
N$168
  Bottom 0.2: U3.6 139.89,119.25 R37.1
NRST  (via drill 0.3 pad 0.6)
  Top 0.2: 129.84,149.77 129.84,116.59 129.75,116.5 129.75,113.68 v129.81,113.62 129.58,113.39 129.58,107.52 131.2,105.9 132.37,105.9 133.21,106.74 133.21,109.03 132.25,109.99 132.25,110.97 v133.73,112.45 133.73,115.39 135.43,117.09 135.43,117.31 135.73,117.61 IC1.14 | 129.98,152.5 129.22,153.27 129.22,154.97 SW3.2_1 | v156.57,108.79 157.06,109.28 v157.06,127.5 | 129.84,149.77 129.98,149.91 129.98,152.5 | 129.84,149.77 v127.96,149.77 | 129.98,152.5 SW3.2_2
  Bottom 0.2: 142.82,109.04 143.13,109.35 154.99,109.35 155.62,108.72 R9.2 156.24,108.46 v156.57,108.79 | R4.1 157.65,128.09 v157.06,127.5 | 142.82,109.04 142.78,109 | C5.2 130.52,113.62 v129.81,113.62 | 141.08,108.87 141.08,106.15 141.38,105.85 141.38,105.69 141.69,105.39 142.29,105.39 142.6,105.69 R11.1 | v133.73,112.45 136.25,109.94 139.07,109.94 140.14,108.87 141.08,108.87 | CR3.2 128.16,149.97 v127.96,149.77 | 142.78,109 141.2,109 141.08,108.87 | 142.82,109.04 142.78,109
PC13  (via drill 0.3 pad 0.6)
  Top 0.2: v137.9,120.97 137.76,121.11 IC1.7
  Bottom 0.2: v137.9,120.97 137.48,120.55 R3.2
PE3  (via drill 0.3 pad 0.6)
  Top 0.2: IC1.2 135.75,123.61 135.46,123.89 135.46,130.12 v136.01,130.67
  Bottom 0.2: v136.01,130.67 135.55,131.14 R5.1
QSPI_BK1_IO0  (via drill 0.3 pad 0.6)
  Top 0.2: IC1.58 151.05,115.61 150.35,114.91 v150.35,114.69
  Bottom 0.2: v150.35,114.69 150.31,114.69 149.35,115.66 R38.2
QSPI_BK1_IO1  (via drill 0.3 pad 0.6)
  Top 0.2: v149.71,119.01 149.71,117.43 151.03,116.11 IC1.59
  Bottom 0.2: v149.71,119.01 149.36,119.01 148.66,119.71 R34.1
QSPI_BK1_IO2  (via drill 0.3 pad 0.6)
  Top 0.2: v137.06,125.62 137.06,124.59 IC1.1 | v137.06,125.62 | v137.06,125.62 | v137.06,125.62 | v137.06,125.62
  Bottom 0.2: R35.1 139.79,123.44 139.34,123.9 132.7,123.9 131.77,124.83 130.35,124.83 129.51,125.66 129.51,126.46 129.81,126.75 131.98,126.75 132.81,125.92 136.76,125.92 v137.06,125.62
QSPI_BK1_IO3  (via drill 0.3 pad 0.6)
  Top 0.2: IC1.60 152.78,116.61 153.47,115.93 v153.47,114.25
  Bottom 0.2: v153.47,114.25 152.78,114.25 150.29,116.74 147.84,116.74 147.4,116.3 144.15,116.3 143.76,116.68 R36.2
QSPI_BK1_NCS  (via drill 0.3 pad 0.6)
  Top 0.2: v145.97,123.06 146.8,123.06 v147.31,123.56 | IC1.92 142.25,124.61 v141.97,124.33
  Bottom 0.2: v141.97,124.33 142.93,125.29 145.59,125.29 v147.31,123.56 | v145.97,123.06 145.97,123.26 144.78,124.46 144.11,124.46 143.76,124.11 R33.1
QSPI_CLK  (via drill 0.3 pad 0.6)
  Top 0.2: 143.25,112.11 IC1.36 | 143.25,112.11 143.86,112.72 143.86,113.26 143.48,113.64 142.7,113.64 141.29,115.05 141.29,115.83 141.23,115.89 140.96,116.16 v140.96,116.77 | 143.25,112.11
  Bottom 0.2: v140.96,116.77 140.96,116.75 139.81,116.75 139.34,116.27 137.23,116.27 136.84,116.67 R37.2
RCC_MCO_1  (via drill 0.3 pad 0.6)
  Top 0.2: v154.85,147.12 154.85,126 155.49,125.35 155.49,122.82 152.78,120.11 IC1.67
  Bottom 0.2: R16.1 160.02,149.02 159.17,148.18 158.07,148.18 157.01,147.12 v154.85,147.12
SPIX_CLK  (via drill 0.3 pad 0.6)
  Top 0.2: v147.95,112.27 146.36,112.27 144.14,114.49 142.99,114.49 142.09,115.38 142.09,115.76 143.75,117.42 IC1.89
  Bottom 0.2: U7.6 142.24,111 147.54,111 147.95,111.41 v147.95,112.27
SPIX_CS  (via drill 0.3 pad 0.6)
  Top 0.2: IC1.87 144.75,114.78 v144.89,114.65
  Bottom 0.2: v144.89,114.65 145.36,114.17 U7.1
SPIX_MISO  (via drill 0.3 pad 0.6)
  Top 0.2: 141.63,116.06 141.52,116.17 | v144.56,112.63 144.56,113.16 143.67,114.04 142.86,114.04 141.69,115.22 141.69,116 141.63,116.06 | 141.52,116.17 141.39,116.3 | IC1.90 143.25,118.16 141.39,116.3 | 141.39,116.3 | 141.63,116.06 141.52,116.17
  Bottom 0.2: U7.2 144.83,112.9 v144.56,112.63
SPIX_MOSI  (via drill 0.3 pad 0.6)
  Top 0.2: v143.1,115.25 144.25,116.41 IC1.88
  Bottom 0.2: v143.1,115.25 143.1,114.02 142.62,113.54 140.57,113.54 140.27,113.24 140.27,111.29 141.2,110.36 U7.5
SYS_RESET
  Bottom 0.2: R11.2 141.62,106.26 C20.2
USB_CC1  (via drill 0.3 pad 0.6)
  Top 0.2: v156.53,70.39 156.14,70 154.86,70 153.23,71.64 J2.A5
  Bottom 0.2: R14.2 155.78,75.3 157.31,75.3 157.6,75 157.6,73.88 156.45,72.72 156.45,70.47 v156.53,70.39
USB_CC2  (via drill 0.3 pad 0.6)
  Top 0.2: J2.B5 156.23,71.17 v155.7,70.65
  Bottom 0.2: R15.2 151.69,74.04 152.88,72.85 152.88,72.35 154.71,70.52 155.57,70.52 v155.7,70.65
USB_DN  (via drill 0.3 pad 0.6)
  Top 0.2: IC1.70 151.04,121.61 149.11,119.67 149.11,115.08 150.83,113.36 150.83,107 153.39,104.43 v153.39,73.37 153.73,73.03 J2.B7 | J2.A7 154.73,71.36 v154.95,71.14
  Bottom 0.2: v154.95,71.14 154.95,71.81 v153.39,73.37 153.74,73.71 154.24,73.71 CR6.2
USB_DP  (via drill 0.3 pad 0.6)
  Top 0.2: J2.B6 155.23,73.17 | 155.23,73.17 v155.23,73.93 153.93,75.22 153.93,111.5 v153.54,111.89 | v150.07,112.9 148.7,114.27 148.7,119.92 150.89,122.11 IC1.71 | 155.23,73.17 154.52,73.17 154.23,72.87 J2.A6
  Bottom 0.2: v150.07,112.9 151.09,111.89 v153.54,111.89 | CR7.2 156,74.3 155.59,74.3 v155.23,73.93
VBAT  (via drill 0.3 pad 0.6)
  Top 0.2: IC1.6 134.72,121.61 132.95,123.39 132.95,126.64 v132.75,126.84
  Bottom 0.2: D1.3 133.89,125 137.32,125 137.68,125.35 137.68,125.85 137.19,126.34 133.24,126.34 v132.75,126.84
VDD-MCU  (via drill 0.3 pad 0.6)
  Top 0.2: v148.59,102.17 149.56,101.2 v149.56,99.29 150.34,100.08 150.34,110.35 IC1.50 | v137.41,108.58 137.41,107.1 138.15,106.36 | IC1.11 135.01,119.11 | v144.9,128.18 144.9,152.1 SW1.1_2 145.6,153.61 145.6,155 SW1.1_1 | v151.14,128.6 151.14,124.9 IC1.75 | IC1.100 138.25,127.53 v138.4,127.67 138.38,127.7 138.38,136.41 138.93,136.97 138.93,151.72 SW2.1_2 139.23,153.59 139.23,155.02 SW2.1_1 | 138.15,106.36 v138.15,101.69 | 138.15,106.36 | v132.32,125.48 132.32,121.8 135.01,119.11 | v131.78,107.32 131.57,107.54 131.57,108.97 131.4,109.14 131.4,115.5 135.01,119.11
  Bottom 0.2: 153.53,118.84 154.49,118.84 154.71,118.62 154.71,116.26 154.44,115.99 153.53,115.99 | 148.76,127.82 145.26,127.82 v144.9,128.18 144.46,127.75 141.69,127.75 | 153.87,122.36 153.53,122.02 C13.2 | C19.2 149.56,98.73 v149.56,99.29 | 153.53,115.99 C17.2 | 153.53,118.84 C14.2 153.53,120.3 154.75,121.51 154.75,122.04 154.43,122.36 153.87,122.36 | 141.69,127.75 141.69,126.88 139.18,124.37 132.82,124.37 132.32,124.87 v132.32,125.48 131.36,125.48 D1.2 | 150.34,129.4 150.34,129.42 R8.1 | v138.4,127.67 138.47,127.75 141.69,127.75 | C12.2 153.53,122.69 153.87,122.36 | v148.59,102.17 138.62,102.17 v138.15,101.69 | FL1.2 132.32,113.01 136.37,108.96 | v138.4,127.67 138.25,127.82 D2.2 | 153.53,115.99 C16.2 152.89,117.19 145.68,117.19 145.23,117.63 145.23,118.36 145.49,118.62 147.76,118.62 148.38,117.99 150.12,117.99 150.71,118.59 150.71,125.87 148.76,127.82 | C15.2 153.53,118.84 | v151.14,128.6 150.34,129.4 | v138.4,127.67 | 136.37,108.96 136.37,108.11 135.59,107.32 v131.78,107.32 | 136.37,108.96 U1.3 138.09,108.58 v137.41,108.58 | 150.34,129.4 | 150.34,129.4 148.76,127.82
(copper drawn outside any net)
  Top 0.2: 116.84,159 173.23,159 173.23,63.5 116.84,63.5 116.84,159